# EAGLE design segnalazione_acustico_luminosa (EAGLE 9.6.2)
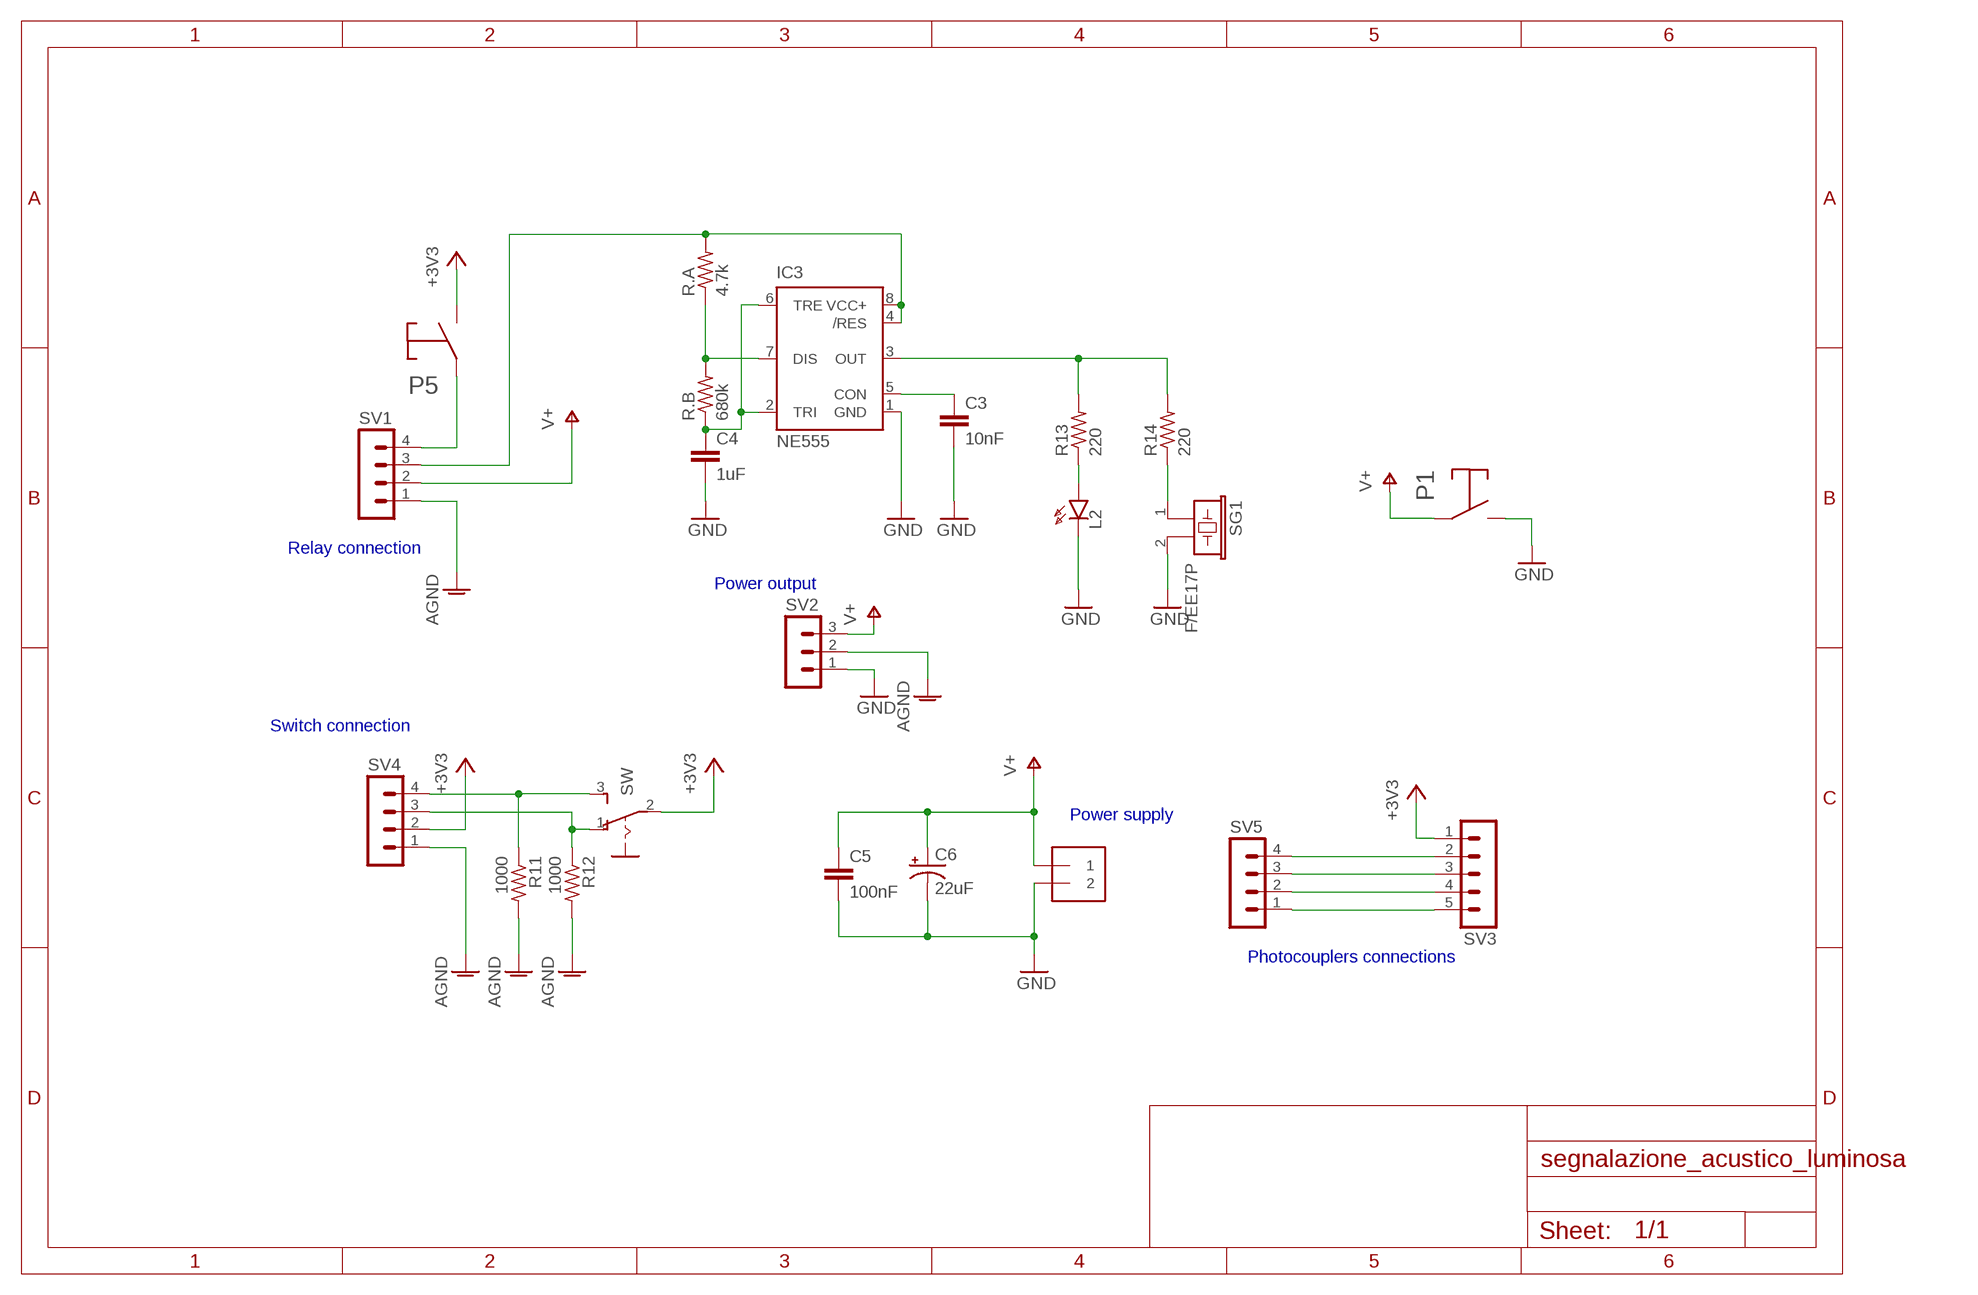
[diagram p0: schematic, sheet 1]

## Parts
C3  10nF  C-EU025-024X044  [C025-024X044]
C4  1uF  C-EU025-024X044  [C025-024X044]
C5  100nF  C-EU025-024X044  [C025-024X044]
C6  22uF  CPOL-USE2,5-6E  [E2,5-6E]
IC3  NE555  [DIL-08]
J1  1X2-3.5MM  [1X2-3.5MM]
L2  HLMP6  [HLMP6]
P1  PULS  [2TULIP]
P5  PULS  [2TULIP]
R11  1000  R-US_0207/10  [0207/10]
R12  1000  R-US_0207/10  [0207/10]
R13  220  R-US_0207/10  [0207/10]
R14  220  R-US_0207/10  [0207/10]
R.A  4.7k  R-US_0207/10  [0207/10]
R.B  680k  R-US_0207/10  [0207/10]
SG1  F/EE17P  [F/EE17P]
SV1  MA04-1  [MA04-1]
SV2  MA03-1  [MA03-1]
SV3  MA05-1  [MA05-1]
SV4  MA04-1  [MA04-1]
SV5  MA04-1  [MA04-1]
SW  M251  [M251]

## Nets
+3V3: P5.1 SV3.1 SV4.2 SW.2(P)
AGND [GND1]: R11.2 R12.2 SV1.1 SV2.2 SV4.1
GND [GND1]: C3.2 C4.2 C5.2 C6.- IC3.1(GND) J1.2 L2.K P1.1 SG1.2 SV2.1
N$1: IC3.4(/RES) IC3.8(VCC+) R.A.2 SV1.3
N$5: R11.1 SV4.4 SW.3(S)
N$31: P5.2 SV1.4
N$32: R12.1 SV4.3 SW.1(O)
N$33: SV3.2 SV5.4
N$34: SV3.3 SV5.3
N$36: SV3.4 SV5.2
N$37: SV3.5 SV5.1
N$40: R14.1 SG1.1
N$41: L2.A R13.1
N$55: C3.1 IC3.5(CON)
N$57: IC3.7(DIS) R.A.1 R.B.2
N$58: IC3.3(OUT) R13.2 R14.2
N$59: C4.1 IC3.2(TRI) IC3.6(TRE) R.B.1
V+: C5.1 C6.+ J1.1 P1.2 SV1.2 SV2.3

## Notes on the sheet
- Relay connection
- Power output
- Switch connection
- Power supply
- Photocouplers connections

## Library data of the parts
C3-C5 = rcl:C-EU: CAPACITOR, European symbol; SPICEPREFIX: C
C6 = rcl:CPOL-US: POLARIZED CAPACITOR, American symbol; SPICEPREFIX: C
IC3 = st-microelectronics:NE555: General purpose bipolar Timer; MF: Arrow Electronics; MPN: NE555N; OC_FARNELL: 1467742; OC_NEWARK: 89K1486
J1 = adafruit:1X2: 3.5mm Terminal block http://www.ladyada.net/library/pcb/eaglelibrary.html
L2 = display-hp:HLMP6: LED 2mm horizontal; MF: AGILENT TECHNOLOGIES; MPN: HLMP-6500; OC_FARNELL: 1652490; OC_NEWARK: 40K0088
P1 P5 = PROVA1:PULS
R11-R14 R.A R.B = rcl:R-US_: RESISTOR, American symbol; SPICEPREFIX: R
SG1 = buzzer:F/EE17P: BUZZER Source: Buerklin; OC_FARNELL: unknown; OC_NEWARK: unknown
SV1 SV4 SV5 = con-lstb:MA04-1: PIN HEADER; OC_FARNELL: unknown; OC_NEWARK: unknown
SV2 = con-lstb:MA03-1: PIN HEADER; OC_FARNELL: unknown; OC_NEWARK: unknown
SV3 = con-lstb:MA05-1: PIN HEADER; OC_FARNELL: unknown; OC_NEWARK: unknown
SW = switch:M251: SLIDING SWITCH Mors, distributor Buerklin, 11G702

## Board
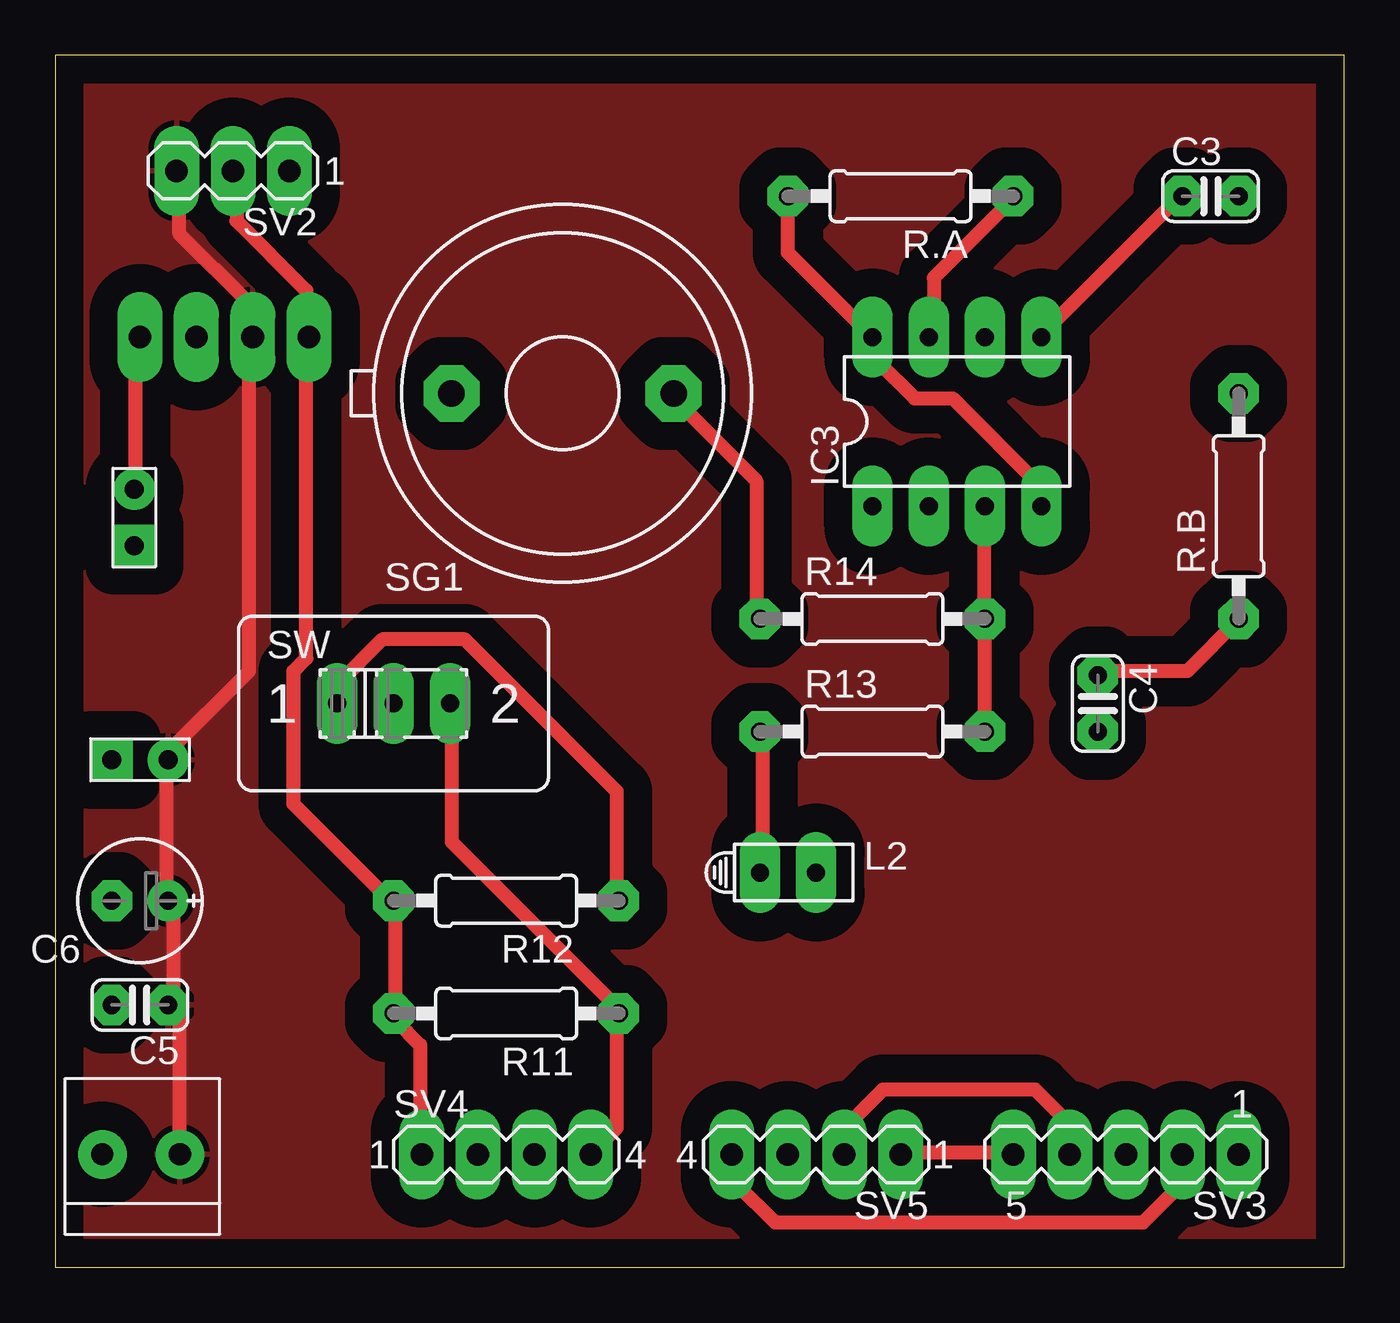
[diagram p1: board, top side]
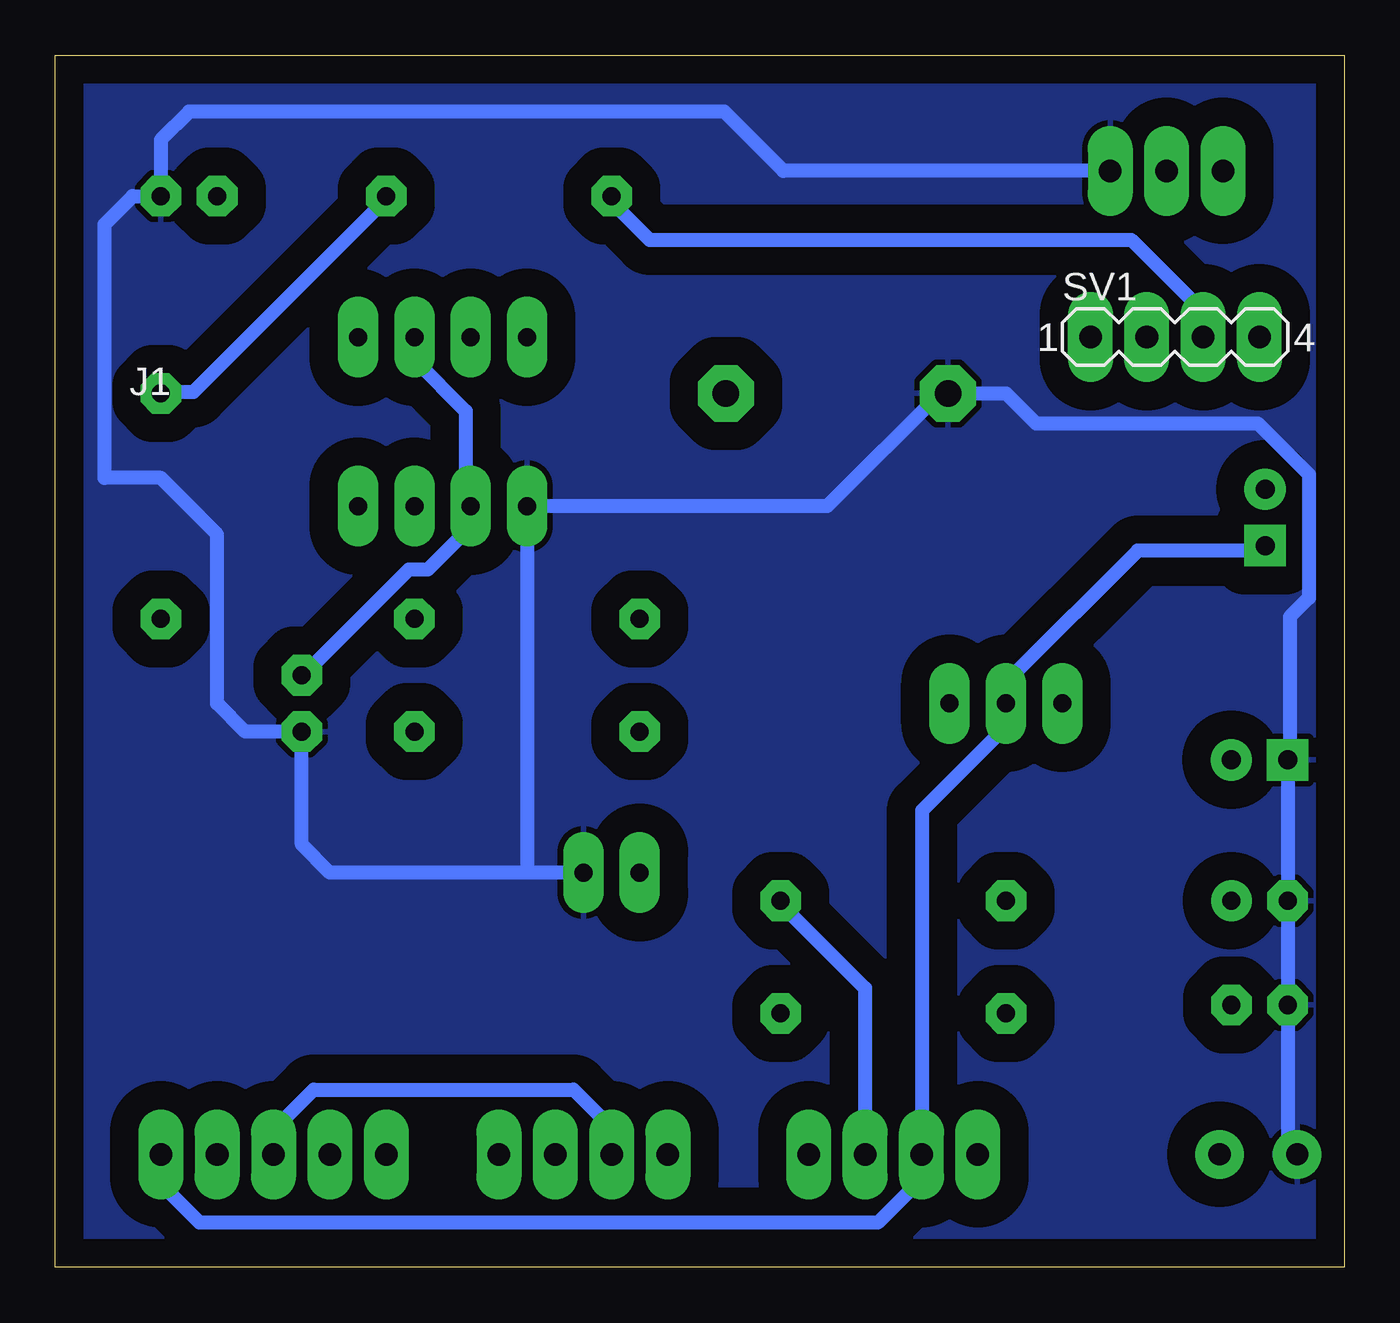
[diagram p2: board, bottom side, seen from below]

Size 58.09 x 54.6 mm. Coordinates in mm from the lower left corner, seen from the top.
Outline: 0,0 58.09,0 58.09,54.6 0,54.6 0,0
Copper layers (1*16): Top 0.035mm / dielectric 1.5mm / Bottom 0.035mm
Design rules "default *": minimum track width 25mil, minimum drill 0.35mm, track to track 20mil, track to pad 20mil, pad to pad 20mil, via to via 20mil, smd to smd 6mil, copper to edge 40mil, drill to drill 6mil, minimum pad ring 20mil, minimum via ring 20mil, stop-mask expansion 4mil, vias tented up to drill 0mil, thermal gap 10mil

### Footprints (pad centres in the part's own frame; a part is rotated, then mirrored left to right if it is on the bottom)
C025-024X044 = drill 0.813 octagon: 1 -1.27,0; 2 1.27,0
E2,5-6E = drill 0.813 pad 1.575: + -1.27,0 | drill 0.813 pad 1.575 octagon: - 1.27,0
DIL-08 = drill 0.813 long: 1 -3.81,-3.81; 2 -1.27,-3.81; 3 1.27,-3.81; 4 3.81,-3.81; 5 3.81,3.81; 6 1.27,3.81; 7 -1.27,3.81; 8 -3.81,3.81
1X2-3.5MM = drill 1 pad 2.184: 1 1.8,0; 2 -1.7,0
HLMP6 = drill 0.813 long: A -1.27,0; K 1.27,0
2TULIP = drill 0.85 pad 1.778 square: 1 0,0 | drill 0.85 pad 1.778: 2 2.54,0
0207/10 = drill 0.813 octagon: 1 -5.08,0; 2 5.08,0
F/EE17P = drill 1.194 pad 2.54 octagon: 1 -5.004,0; 2 5.004,0
MA04-1 = drill 1.016 long: 1 -3.81,0; 2 -1.27,0; 3 1.27,0; 4 3.81,0
MA03-1 = drill 1.016 long: 1 -2.54,0; 2 0,0; 3 2.54,0
MA05-1 = drill 1.016 long: 1 -5.08,0; 2 -2.54,0; 3 0,0; 4 2.54,0; 5 5.08,0
M251 = drill 0.813 long: 1 -2.54,0; 2 0,0; 3 2.54,0

### Placement (x,y rotation side)
C3  52.07,48.26 0 top
C4  46.99,25.4 270 top
C5  3.81,11.81 180 top
C6  3.81,16.51 180 top
IC3  40.64,38.1 0 top
J1  3.81,5.08 0 top
L2  33.02,17.78 0 top
P1  2.54,22.86 0 top
P5  3.56,32.51 90 top
R11  20.32,11.43 180 top
R12  20.32,16.51 180 top
R13  36.83,24.13 0 top
R14  36.83,29.21 0 top
R.A  38.1,48.26 180 top
R.B  53.34,34.29 90 top
SG1  22.86,39.37 180 top
SV1  7.62,41.91 0 bottom
SV2  8,49.4 180 top
SV3  48.26,5.08 180 top
SV4  20.32,5.08 0 top
SV5  34.29,5.08 180 top
SW  15.24,25.4 0 top

### Tracks (layer width: path | path; a pad name or v marks a point on that pad's centre or on a via)
+3V3
  Bottom 0.635: P5.1 3.59,32.29 9.3,32.29 15.02,26.58 15.02,25.43 SW.2 15.3,25.15 15.3,24.29 19.02,20.57 19.02,5.14 SV4.2 19.3,4.86 19.3,3.71 21.02,2 51.59,2 53.31,3.71 53.31,4.86 SV3.1
AGND
  Top 0.635: SV2.2 8.16,49.15 8.16,47.15 11.3,44.01 11.3,42.01 SV1.1 11.3,41.72 11.3,27.43 10.73,26.86 10.73,20.86 15.02,16.57 R12.2 15.3,16.29 15.3,11.43 R11.2 15.3,11.14 16.45,10 16.45,5.14 SV4.1
GND
  Top 0.635: 34.45,18 L2.K | 37.02,34.29 IC3.1 | 53.31,48.01 C3.2 | 46.74,24.29 C4.2 | 10.73,49.15 SV2.1
  Bottom 0.635: 17.59,39.15 SG1.2 | SG1.2 18.16,39.43 23.3,34.29 IC3.1 36.83,17.78 | SG1.2 15.24,39.37 13.89,38.02 3.89,38.02 1.59,35.72 1.59,30.16 2.45,29.3 2.45,22.86 P1.1 C6.- C5.2 2.54,5.51 J1.2 | L2.K 36.83,17.78 | 36.83,17.78 45.72,17.78 46.99,19.05 C4.2 49.53,24.13 50.8,25.4 50.8,33.02 53.34,35.56 55.88,35.56 55.88,46.99 54.61,48.26 C3.2 53.34,50.8 52.07,52.07 27.94,52.07 25.27,49.4 SV2.1
  pour Bottom (isolate 1.27): 0,54.61 58.42,54.61 58.42,0 0,0
N$1
  Top 0.635: IC3.4 44.45,35.15 40.45,39.15 38.73,39.15 37.02,40.86 37.02,41.72 IC3.8 33.02,45.72 R.A.2
  Bottom 0.635: SV1.3 6.45,42.01 6.45,43.15 9.59,46.29 31.31,46.29 33.02,48.01 R.A.2
N$5
  Top 0.635: SV4.4 24.16,5.14 25.31,6.29 25.31,11.43 R11.1 25.31,11.72 17.88,19.14 17.88,25.15 SW.3
N$31
  Top 0.635: P5.2 3.59,35.15 3.59,41.72 SV1.4
N$32
  Top 0.635: SW.1 12.73,25.43 12.73,26.29 14.73,28.29 18.45,28.29 25.31,21.43 25.31,16.57 R12.1
  Bottom 0.635: SV4.3 21.59,12.57 25.31,16.29 R12.1
N$33
  Top 0.635: SV5.4 30.73,4.86 30.73,3.71 32.45,2 49.02,2 50.74,3.71 50.74,4.86 SV3.2
N$34
  Bottom 0.635: SV5.3 33.02,6.29 34.73,8 46.45,8 48.17,6.29 48.17,5.14 SV3.3
N$36
  Top 0.635: SV5.2 35.59,5.14 35.59,6.29 37.31,8 44.16,8 45.59,6.57 45.59,5.14 SV3.4
N$37
  Top 0.635: SV5.1 38.16,5.14 43.02,5.14 SV3.5
N$40
  Top 0.635: R14.1 31.59,29.43 31.59,35.43 27.88,39.15 SG1.1
N$41
  Top 0.635: L2.A 31.88,18 31.88,24 R13.1
N$55
  Top 0.635: IC3.5 44.45,42.01 50.74,48.29 C3.1
N$57
  Top 0.635: IC3.7 39.59,42.01 39.59,44.58 43.02,48.01 R.A.1
  Bottom 0.635: R.B.2 53.31,39.43 51.88,39.43 43.31,48.01 R.A.1
N$58
  Top 0.635: R13.2 41.88,24.29 41.88,29.15 R14.2 41.88,29.43 41.88,34.29 IC3.3
N$59
  Top 0.635: C4.1 47.02,26.86 51.02,26.86 53.31,29.15 R.B.1
  Bottom 0.635: IC3.6 41.88,41.72 41.88,40.86 39.59,38.58 39.59,34.29 IC3.2 39.59,34 39.59,33.15 41.31,31.43 42.16,31.43 46.74,26.86 C4.1
V+
  Top 0.635: SV2.3 5.59,49.15 5.59,46.58 8.73,43.43 8.73,42.01 SV1.2 8.73,41.72 8.73,26.86 5.02,23.15 P1.2 5.02,22.86 5.02,16.57 C6.+ 5.3,16.29 5.3,12 C5.1 5.59,12 5.59,5.14 J1.1
  pour Top (isolate 1.27): 0,54.61 58.42,54.61 58.42,0 0,0